# EAGLE design CCM_0010 (EAGLE 9.5.1)

## Sheet 1 of 3: doc
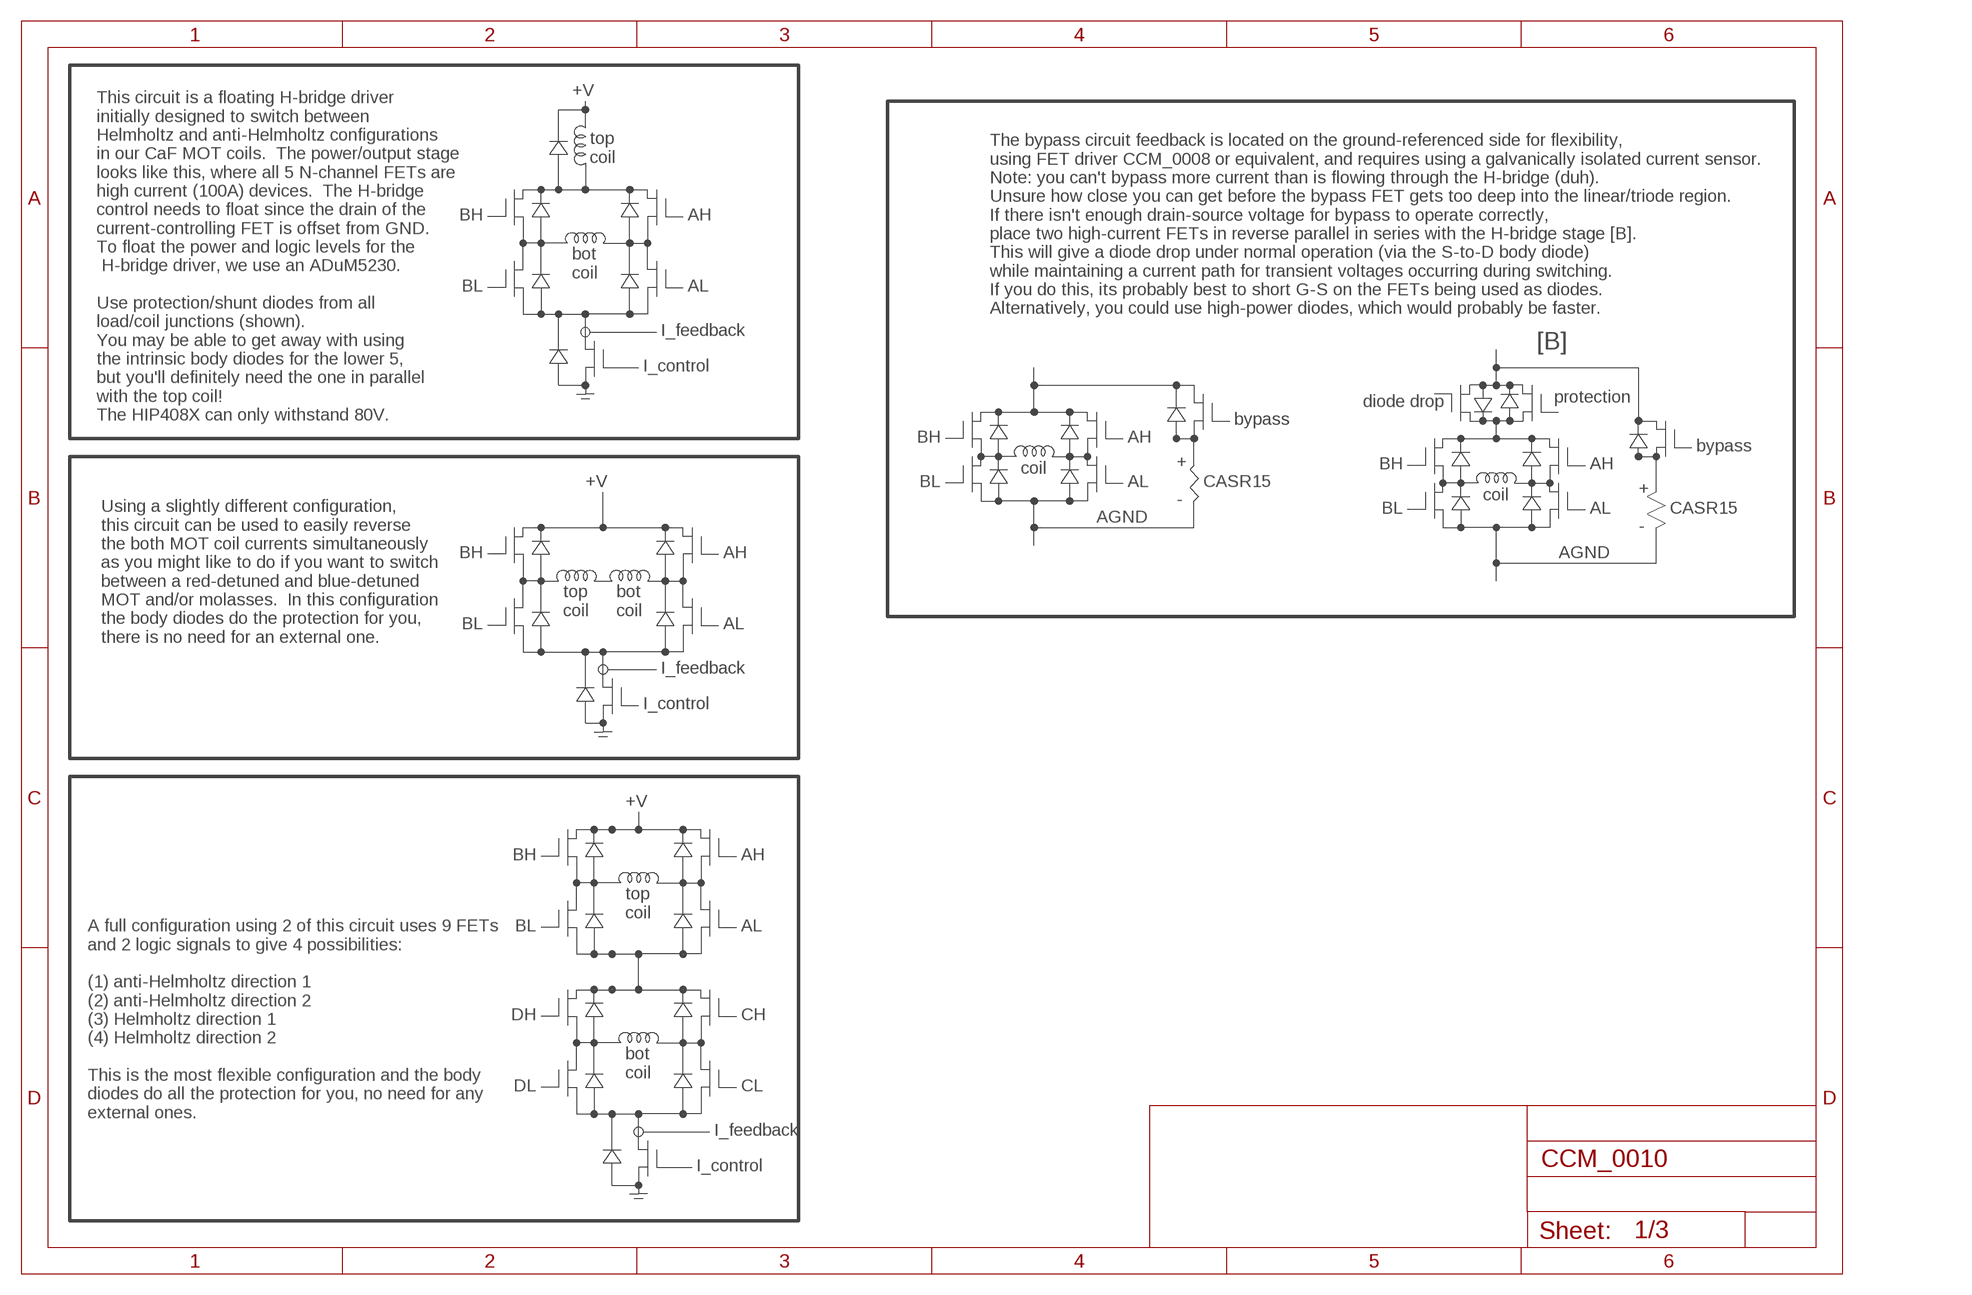
[diagram p0: schematic, sheet 1]

### Notes on the sheet
- +V
- top 
  coil
- BH | AH
- bot 
  coil
- BL | AL
- The bypass circuit feedback is located on the ground-referenced side for flexibility, 
  using FET driver CCM_0008 or equivalent, and requires using a galvanically isolated current sensor.
  Note: you can't bypass more current than is flowing through the H-bridge (duh).
  Unsure how close you can get before the bypass FET gets too deep into the linear/triode region.  
  If there isn't enough drain-source voltage for bypass to operate correctly,
  place two high-current FETs in reverse parallel in series with the H-bridge stage [B].
  This will give a diode drop under normal operation (via the S-to-D body diode)
  while maintaining a current path for transient voltages occurring during switching.
  If you do this, its probably best to short G-S on the FETs being used as diodes.
  Alternatively, you could use high-power diodes, which would probably be faster.
- I_feedback
- [B]
- I_control
- diode drop | protection
- This circuit is a floating H-bridge driver
  initially designed to switch between 
  Helmholtz and anti-Helmholtz configurations 
  in our CaF MOT coils.  The power/output stage 
  looks like this, where all 5 N-channel FETs are 
  high current (100A) devices.  The H-bridge 
  control needs to float since the drain of the 
  current-controlling FET is offset from GND.  
  To float the power and logic levels for the 
   H-bridge driver, we use an ADuM5230.
  
  Use protection/shunt diodes from all 
  load/coil junctions (shown).  
  You may be able to get away with using
  the intrinsic body diodes for the lower 5,
  but you'll definitely need the one in parallel
  with the top coil! 
  The HIP408X can only withstand 80V.
- bypass
- BH | AH
- bypass
- coil | BH | AH
- +V | BL | AL | CASR15
- coil
- +
  
  -
- BL | AL | CASR15
- AGND
- +
  
  -
- BH | AH | AGND
- top 
  coil
- bot 
  coil
- BL | AL
- Using a slightly different configuration, 
  this circuit can be used to easily reverse 
  the both MOT coil currents simultaneously 
  as you might like to do if you want to switch 
  between a red-detuned and blue-detuned 
  MOT and/or molasses.  In this configuration 
  the body diodes do the protection for you,
  there is no need for an external one.
- I_feedback
- I_control
- +V
- BH | AH
- top 
  coil
- BL | AL
- DH | CH
- bot 
  coil
- DL | CL
- A full configuration using 2 of this circuit uses 9 FETs
  and 2 logic signals to give 4 possibilities:
  
  (1) anti-Helmholtz direction 1
  (2) anti-Helmholtz direction 2
  (3) Helmholtz direction 1
  (4) Helmholtz direction 2
  
  This is the most flexible configuration and the body
  diodes do all the protection for you, no need for any
  external ones.
- I_feedback
- I_control

## Sheet 2 of 3: h-bridge drive
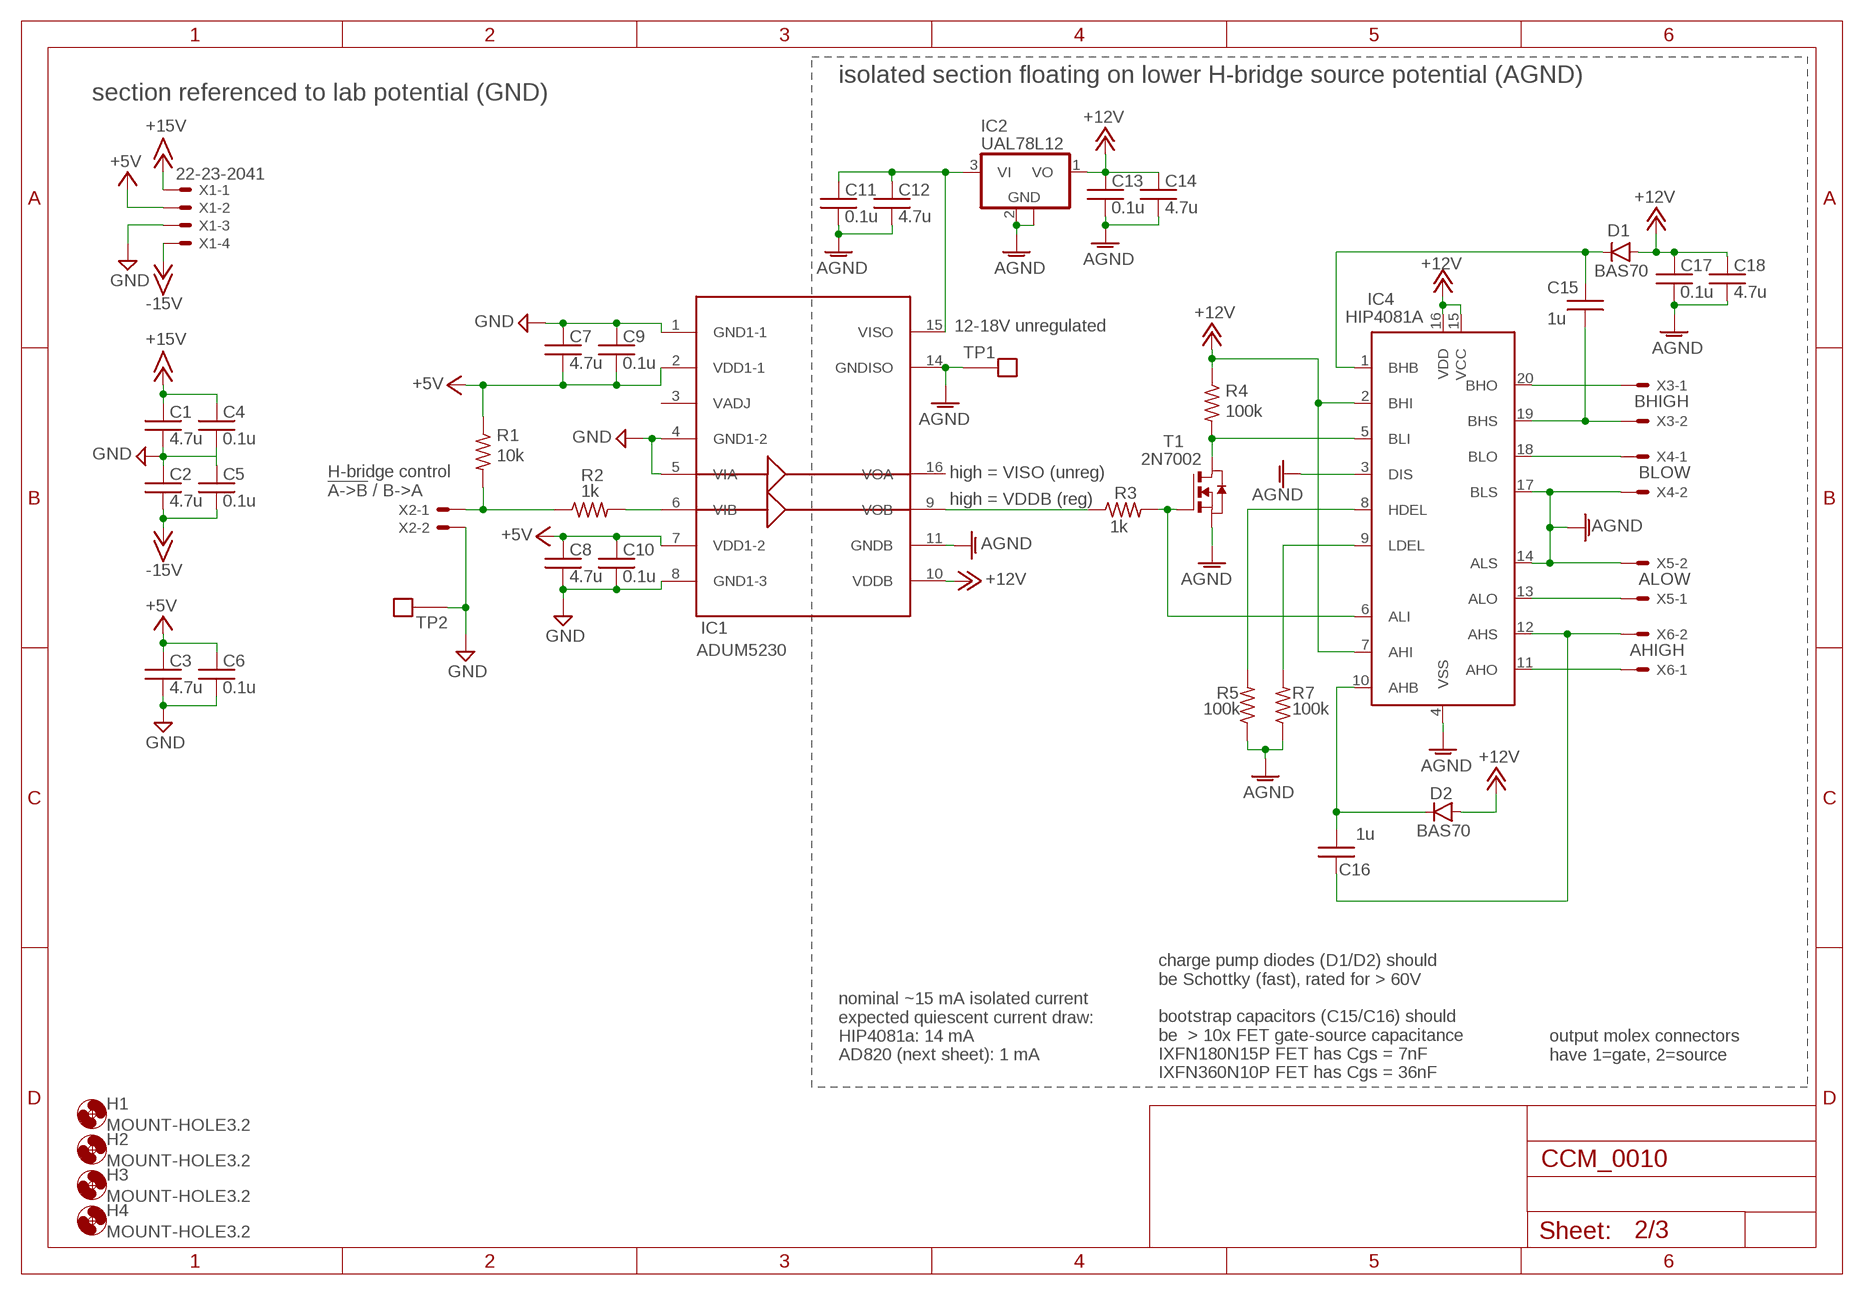
[diagram p1: schematic, sheet 2]

### Parts
C1  4.7u  C0603  [0603]
C2  4.7u  C0603  [0603]
C3  4.7u  C0603  [0603]
C4  0.1u  C0603  [0603]
C5  0.1u  C0603  [0603]
C6  0.1u  C0603  [0603]
C7  4.7u  C0603  [0603]
C8  4.7u  C0603  [0603]
C9  0.1u  C0603  [0603]
C10  0.1u  C0603  [0603]
C11  0.1u  C0603  [0603]
C12  4.7u  C0603  [0603]
C13  0.1u  C0603  [0603]
C14  4.7u  C0603  [0603]
C15  1u  C0603  [0603]
C16  1u  C0603  [0603]
C17  0.1u  C0603  [0603]
C18  4.7u  C0603  [0603]
D1  BAS70  DIODESOT23  [SOT23-3]
D2  BAS70  DIODESOT23  [SOT23-3]
H1  MOUNT-HOLE3.2  [3,2]
H2  MOUNT-HOLE3.2  [3,2]
H3  MOUNT-HOLE3.2  [3,2]
H4  MOUNT-HOLE3.2  [3,2]
IC1  ADUM5230  [SO16W]
IC2  UAL78L12  78L12F  [SOT89]
IC4  HIP4081A  [SO20]
R1  10k  R0603  [0603]
R2  1k  R0603  [0603]
R3  1k  R0603  [0603]
R4  100k  R0603  [0603]
R5  100k  R0603  [0603]
R7  100k  R0603  [0603]
T1  2N7002  NMOSSOT23  [SOT-23]
TP1  TESTPOINT  [TESTPOINT]
TP2  TESTPOINT  [TESTPOINT]
X1  22-23-2041  [22-23-2041]
X2  22-23-2021  [22-23-2021]
X3  22-23-2021  [22-23-2021]
X4  22-23-2021  [22-23-2021]
X5  22-23-2021  [22-23-2021]
X6  22-23-2021  [22-23-2021]

### Nets
+5V: C3.1 C6.1 C7.2 C8.1 C9.2 C10.1 IC1.2(VDD1-1) IC1.7(VDD1-2) R1.1 X1.2
+12V: C13.1 C14.1 C17.1 C18.1 D1.1(A) D2.1(A) IC1.10(VDDB) IC2.1(VO) IC4.2(BHI) IC4.7(AHI) IC4.15(VCC) IC4.16(VDD) R4.1 ; also sheet 3
+15V: C1.1 C4.1 X1.1 ; also sheet 3
-15V: C2.2 C5.2 X1.4 ; also sheet 3
AGND: C11.2 C12.2 C13.2 C14.2 C17.2 C18.2 IC1.11(GNDB) IC1.14(GNDISO) IC2.2(GND) IC2.2@1(GND) IC4.3(DIS) IC4.4(VSS) IC4.14(ALS) IC4.17(BLS) R5.1 R7.1 T1.2(S) TP1.P$1 X4.2 X5.2 ; also sheet 3
GND: C1.2 C2.1 C3.2 C4.2 C5.1 C6.2 C7.1 C8.2 C9.1 C10.2 IC1.1(GND1-1) IC1.4(GND1-2) IC1.5(VIA) IC1.8(GND1-3) TP2.P$1 X1.3 X2.2 ; also sheet 3
N$1: IC4.18(BLO) X4.1
N$4: IC4.13(ALO) X5.1
N$5: IC4.8(HDEL) R5.2
N$8: C16.1 D2.3(C) IC4.10(AHB)
N$10: C11.1 C12.1 IC1.15(VISO) IC2.3(VI)
N$13: IC1.9(VOB) R3.1
N$16: C16.2 IC4.12(AHS) X6.2
N$17: C15.2 D1.3(C) IC4.1(BHB)
N$20: IC4.9(LDEL) R7.2
N$21: IC4.5(BLI) R4.2 T1.1(D)
N$22: IC4.6(ALI) R3.2 T1.3(G)
N$23: C15.1 IC4.19(BHS) X3.2
N$24: IC4.20(BHO) X3.1
N$28: R1.2 R2.1 X2.1
N$30: IC1.6(VIB) R2.2
N$33: IC4.11(AHO) X6.1
Unconnected: IC1.3(VADJ) IC1.16(VOA)

### Notes on the sheet
- isolated section floating on lower H-bridge source potential (AGND)
- section referenced to lab potential (GND)
- 12-18V unregulated
- BHIGH
- high = VISO (unreg) | BLOW
- H-bridge control
  !A->B! / B->A
- high = VDDB (reg)
- ALOW
- AHIGH
- nominal ~15 mA isolated current
  expected quiescent current draw: 
  HIP4081a: 14 mA
  AD820 (next sheet): 1 mA
- output molex connectors
  have 1=gate, 2=source
- charge pump diodes (D1/D2) should
  be Schottky (fast), rated for > 60V
  
  bootstrap capacitors (C15/C16) should 
  be  > 10x FET gate-source capacitance
  IXFN180N15P FET has Cgs = 7nF
  IXFN360N10P FET has Cgs = 36nF

## Sheet 3 of 3: bypass
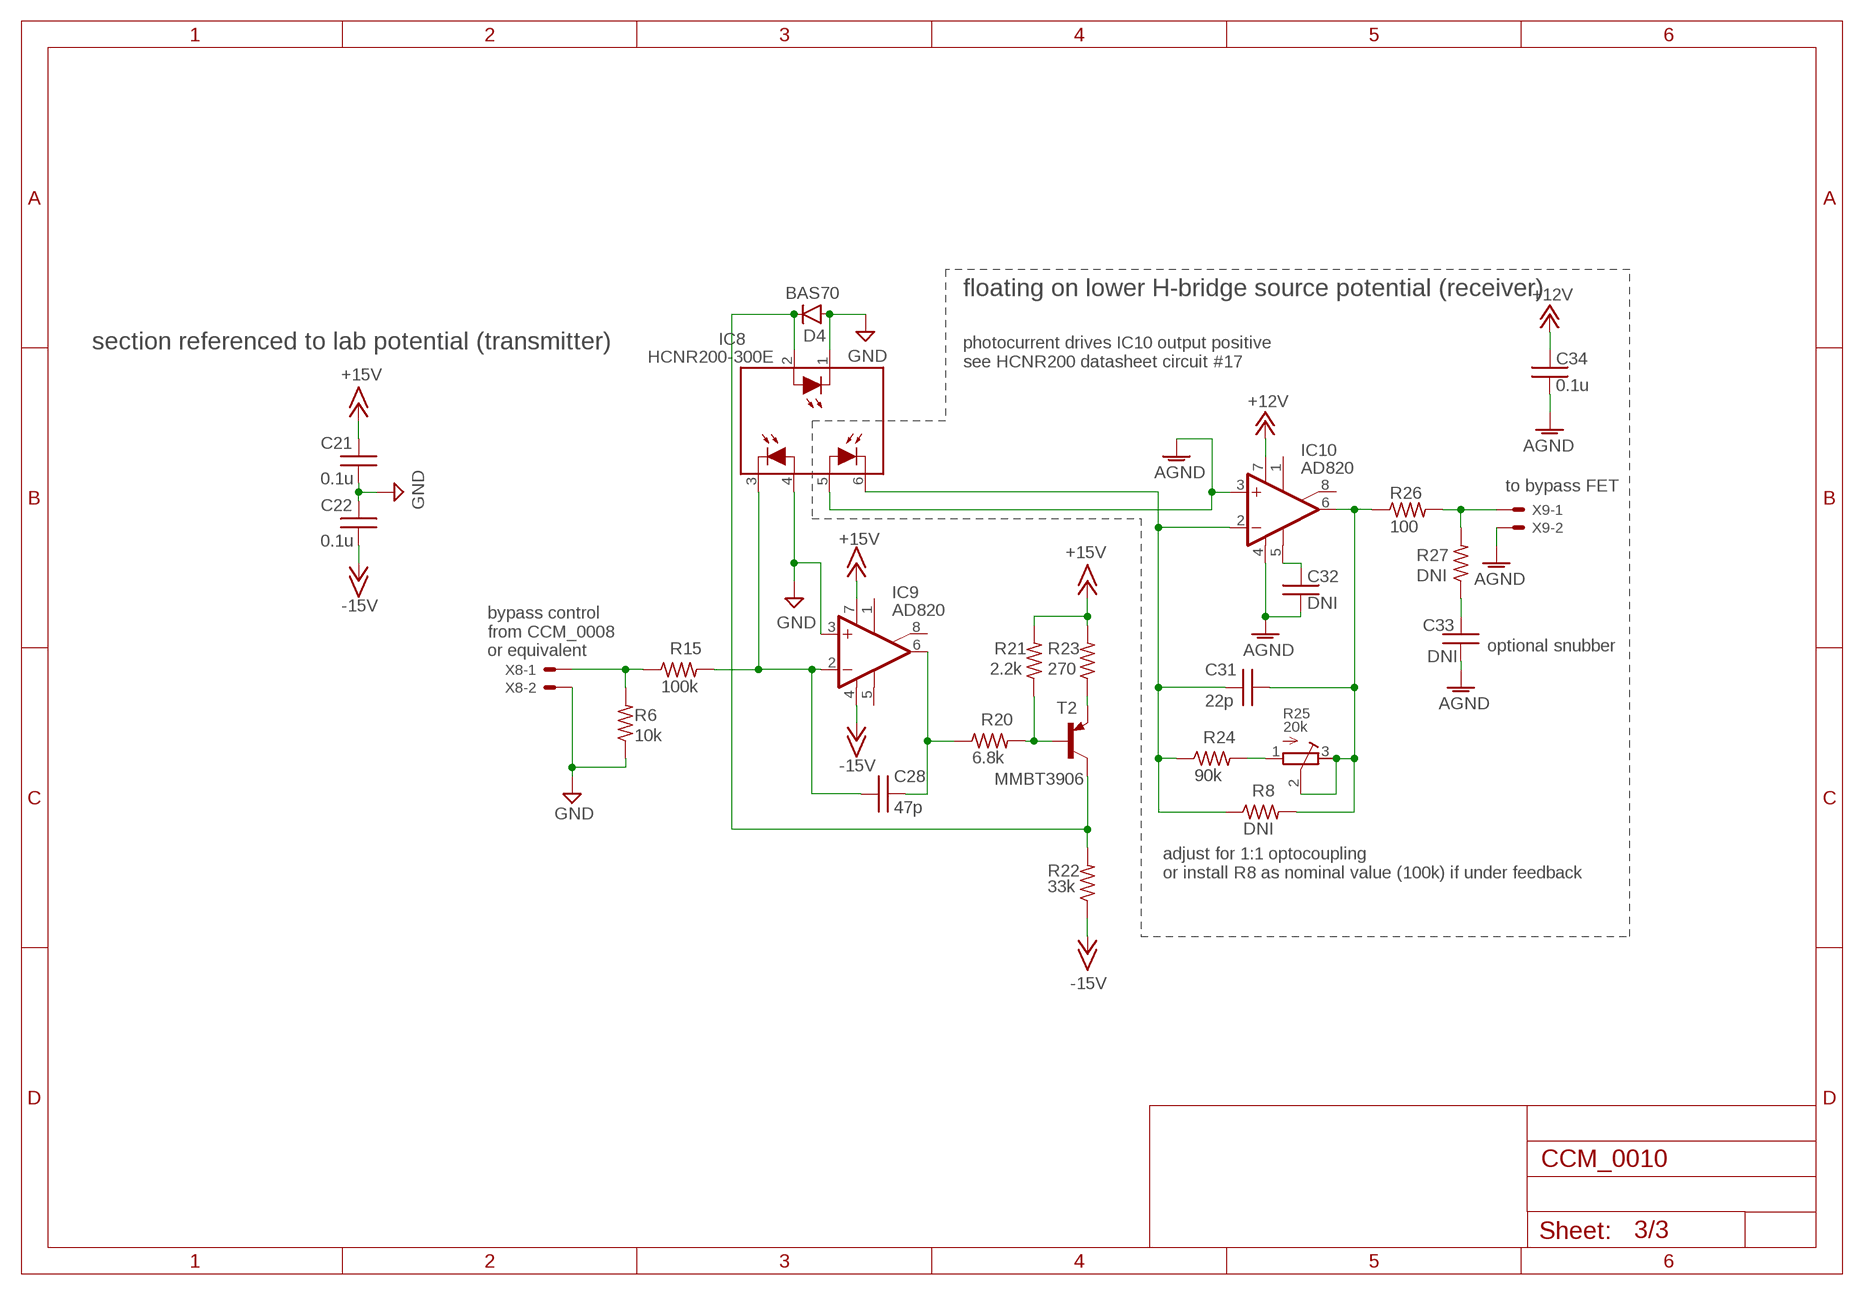
[diagram p2: schematic, sheet 3]

### Parts
C21  0.1u  C0603  [0603]
C22  0.1u  C0603  [0603]
C28  47p  C0603  [0603]
C31  22p  C0603  [0603]
C32  DNI  C0603  [0603]
C33  DNI  C0603  [0603]
C34  0.1u  C0603  [0603]
D4  BAS70  DIODESOT23  [SOT23-3]
IC8  HCNR200-300E  [DIP8-400]
IC9  AD820  OP07CR  [SO08]
IC10  AD820  OP07CR  [SO08]
R6  10k  R0603  [0603]
R8  DNI  R0603  [0603]
R15  100k  R0603  [0603]
R20  6.8k  R0603  [0603]
R21  2.2k  R0603  [0603]
R22  33k  R0603  [0603]
R23  270  R0603  [0603]
R24  90k  R0603  [0603]
R25  20k  R-TRIMM3224W  [RTRIM3224W]
R26  100  R0603  [0603]
R27  DNI  R0603  [0603]
T2  MMBT3906  MMBT3906LT1-PNP-SOT23-BEC  [SOT23-BEC]
X8  22-23-2021  [22-23-2021]
X9  22-23-2021  [22-23-2021]

### Nets
+12V: C34.1 IC10.7(V+) ; also sheet 2
+15V: C21.2 IC9.7(V+) R21.2 R23.2 ; also sheet 2
-15V: C22.1 IC9.4(V-) R22.1 ; also sheet 2
AGND: C32.2 C33.2 C34.2 IC8.5(A2) IC10.3(+IN) IC10.4(V-) X9.2 ; also sheet 2
GND: C21.1 C22.2 D4.1(A) IC8.1(C) IC8.4(A1) IC9.3(+IN) R6.1 X8.2 ; also sheet 2
N$2: C32.1 IC10.5(OPT)
N$3: D4.3(C) IC8.2(A) R22.2 T2.C
N$6: C33.1 R27.1
N$7: R6.2 R15.1 X8.1
N$9: C28.2 IC8.3(C1) IC9.2(-IN) R15.2
N$11: R24.2 R25.1(A)
N$12: C28.1 IC9.6(OUT) R20.1
N$14: R20.2 R21.1 T2.B
N$15: R23.1 T2.E
N$18: C31.2 IC8.6(C2) IC10.2(-IN) R8.1 R24.1
N$19: C31.1 IC10.6(OUT) R8.2 R25.2(S) R25.3(E) R26.1
N$27: R26.2 R27.2 X9.1
Unconnected: IC9.1(ON1) IC9.5(OPT) IC9.8(ON2) IC10.1(ON1) IC10.8(ON2)

### Notes on the sheet
- floating on lower H-bridge source potential (receiver)
- section referenced to lab potential (transmitter)
- photocurrent drives IC10 output positive
  see HCNR200 datasheet circuit #17
- to bypass FET
- optional snubber
- bypass control
  from CCM_0008
  or equivalent
- adjust for 1:1 optocoupling
  or install R8 as nominal value (100k) if under feedback

## Library data of the parts
C1-C18 C21 C22 C28 C31-C34 = acrooptics:C: Capacitor
D1 D2 D4 = WCSMain:DIODE: Diode These are standard reverse protection diodes and small signal diodes. SMA package can handle up to about 1A. SOD-323 can handle about 200mA. What the SOD-323 package when ordering, there are some mfgs out there that are 5-pin packages.
H1-H4 = holes:MOUNT-HOLE: MOUNTING HOLE with drill center marker
IC1 = noah:ADUM5230
IC2 = linear:78L*: POSITOIV-VOLTAGE REGULATORS Output up to 100 mA Source: Datasheet <http://focus.ti.com/lit/ds/symlink/ua78l05.pdf>
IC4 = noah:HIP4081A: H-Bridge N-Channel MOSFET Driver 80V, 0.5A
IC8 = avago:HCNR20*: High-Linearity Analog Optocouplers Source: AV02-0886EN+DS+HCNR200+10Dec2011.pdf
IC9 IC10 = linear:OP07*: OP AMP
R1-R8 R15 R20-R24 R26 R27 = acrooptics:R: 0603 resistor
R25 = resistor:R-TRIMM: Trimm resistor
T1 = zetex:NMOSSOT23: MOS FET; OC_FARNELL: unknown; OC_NEWARK: unknown
T2 = transistor:*-PNP-: PNP Transistror
TP1 TP2 = noah:TESTPOINT
X1 = con-molex:22-23-2041: .100" (2.54mm) Center Header - 4 Pin; MF: MOLEX; MPN: 22-23-2041; OC_FARNELL: 1462920; OC_NEWARK: 38C0355
X2-X6 X8 X9 = con-molex:22-23-2021: .100" (2.54mm) Center Header - 2 Pin; MF: MOLEX; MPN: 22-23-2021; OC_FARNELL: 1462926; OC_NEWARK: 25C3832

## Net classes
1 standard: width 0.61 mm, clearance 0.254 mm

## Board
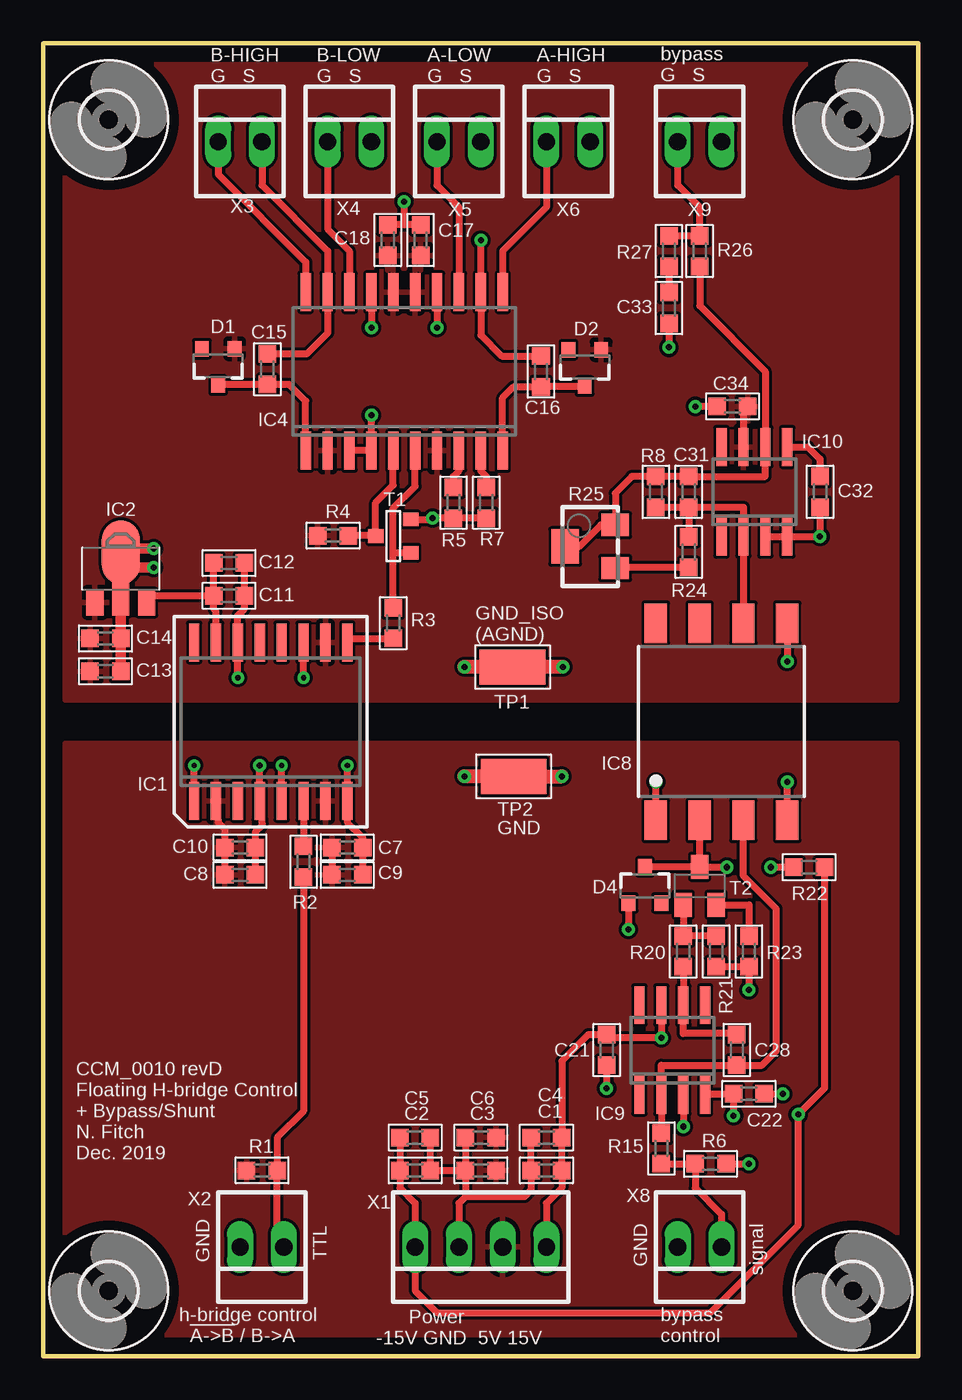
[diagram p3: board, top side]
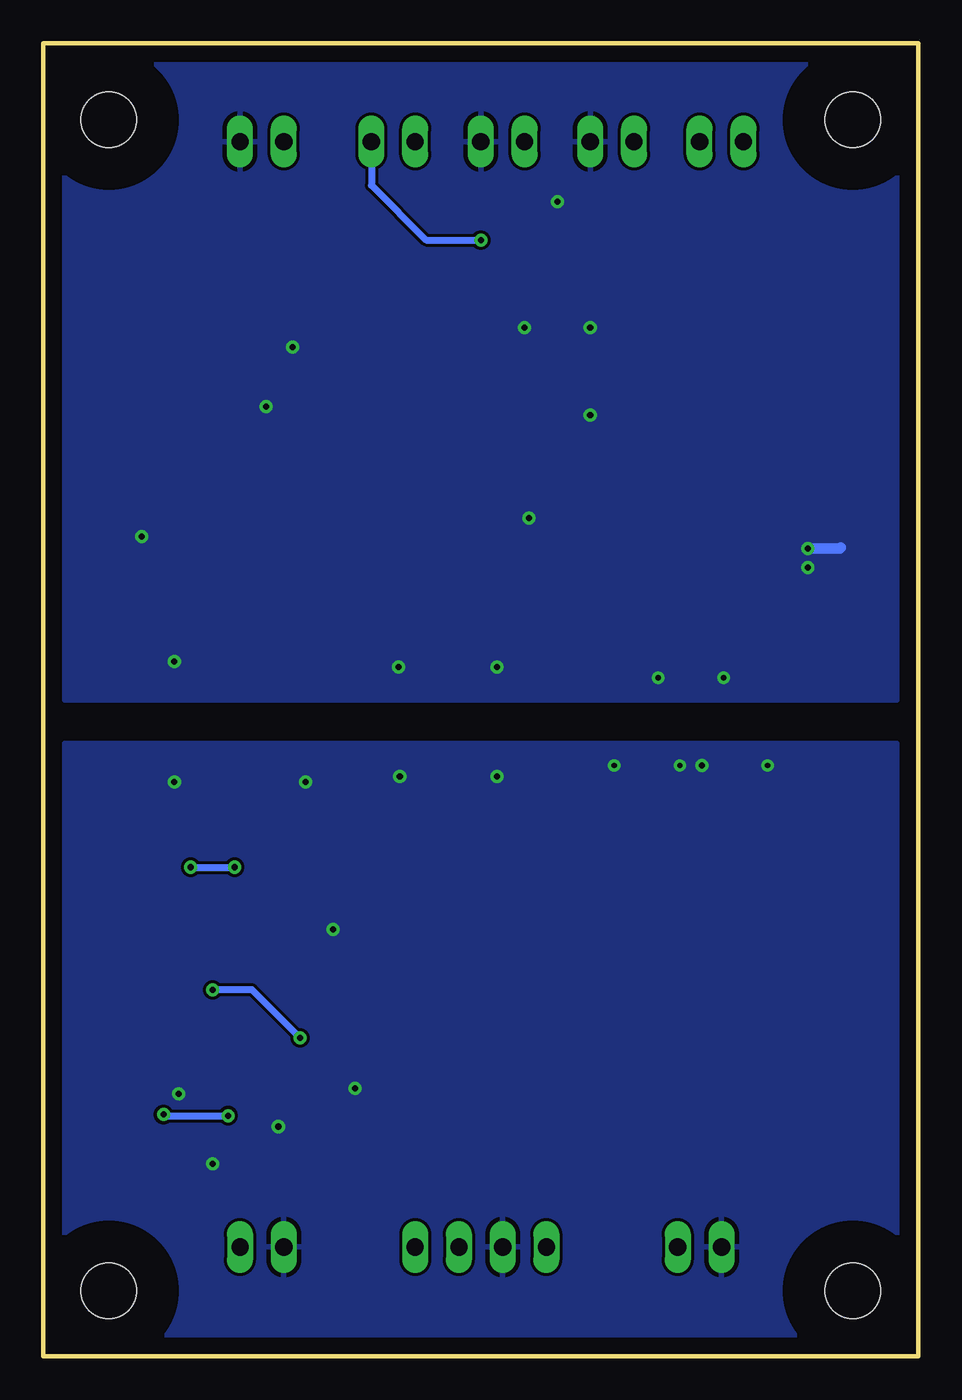
[diagram p4: board, bottom side, seen from below]

Size 50.8 x 76.2 mm. Coordinates in mm from the lower left corner, seen from the top.
Outline: 0,0 50.8,0 50.8,76.2 0,76.2 0,0
Copper layers (1*16): Top 0.035mm / dielectric 1.5mm / Bottom 0.035mm
Design rules "default *": minimum track width 10mil, minimum drill 10mil, track to track 7mil, track to pad 7mil, pad to pad 7mil, via to via 7mil, smd to smd 7mil, copper to edge 10mil, drill to drill 8mil, minimum pad ring 10mil, minimum via ring 8mil, stop-mask expansion 4mil, vias tented up to drill 0mil, thermal gap 10mil

### Footprints (pad centres in the part's own frame; a part is rotated, then mirrored left to right if it is on the bottom)
0603 = smd 1.016 x 1.016: 1 -0.889,0; 2 0.889,0
SOT23-3 = smd 0.8 x 0.9: 1 -0.95,-1; 2 0.95,-1; 3 0,1.1
3,2 = hole 3.2: 0,0
SO16W = smd 0.6 x 2.2: 1 -4.445,-4.6; 2 -3.175,-4.6; 3 -1.905,-4.6; 4 -0.635,-4.6; 5 0.635,-4.6; 6 1.905,-4.6; 7 3.175,-4.6; 8 4.445,-4.6; 9 4.445,4.6; 10 3.175,4.6; 11 1.905,4.6; 12 0.635,4.6; 13 -0.635,4.6; 14 -1.905,4.6; 15 -3.175,4.6; 16 -4.445,4.6
SOT89 = smd 1 x 1.5: 1 -1.499,-1.981; 3 1.499,-1.981 | smd 1 x 2: 2 0,-1.727 | smd 2.2 x 3.7: 2@1 0,0.94
SO20 = smd 0.6 x 2.2: 1 -5.715,-4.6; 2 -4.445,-4.6; 3 -3.175,-4.6; 4 -1.905,-4.6; 5 -0.635,-4.6; 6 0.635,-4.6; 7 1.905,-4.6; 8 3.175,-4.6; 9 4.445,-4.6; 10 5.715,-4.6; 11 5.715,4.6; 12 4.445,4.6; 13 3.175,4.6; 14 1.905,4.6; 15 0.635,4.6; 16 -0.635,4.6; 17 -1.905,4.6; 18 -3.175,4.6; 19 -4.445,4.6; 20 -5.715,4.6
DIP8-400 = smd 1.3 x 2.29: 1 -3.81,-5.72; 2 -1.27,-5.72; 3 1.27,-5.72; 4 3.81,-5.72; 5 3.81,5.72; 6 1.27,5.72; 7 -1.27,5.72; 8 -3.81,5.72
SO08 = smd 0.6 x 2.2: 1 -1.905,-2.6; 2 -0.635,-2.6; 3 0.635,-2.6; 4 1.905,-2.6; 5 1.905,2.6; 6 0.635,2.6; 7 -0.635,2.6; 8 -1.905,2.6
RTRIM3224W = smd 1.3 x 1.6: 1 -1.25,-1.45; 3 1.25,-1.45 | smd 2 x 1.6: 2 0,1.45
SOT-23 = smd 0.787 x 0.889: 1 0.025,-1.016; 2 -0.94,1.016; 3 0.991,1.016
SOT23-BEC = smd 1 x 1.4: B -0.95,-1.1; C 0,1.1; E 0.95,-1.1
TESTPOINT = smd 3.81 x 2.032: P$1 0,0
22-23-2041 = drill 1 long: 1 -3.81,0; 2 -1.27,0; 3 1.27,0; 4 3.81,0
22-23-2021 = drill 1 long: 1 -1.27,0; 2 1.27,0

### Placement (x,y rotation side)
C1  29.21,10.79 180 top
C2  21.59,10.79 180 top
C3  25.4,10.79 180 top
C4  29.21,12.7 180 top
C5  21.59,12.7 180 top
C6  25.4,12.7 180 top
C7  17.65,29.53 180 top
C8  11.43,27.94 0 top
C9  17.65,27.94 180 top
C10  11.43,29.53 0 top
C11  10.79,44.13 0 top
C12  10.79,46.04 0 top
C13  3.62,39.75 0 top
C14  3.62,41.66 0 top
C15  13.02,57.28 270 top
C16  28.89,57.15 90 top
C17  21.91,64.77 90 top
C18  20,64.77 90 top
C21  32.7,17.78 90 top
C22  40.96,15.24 0 top
C28  40.26,17.78 270 top
C31  37.47,50.16 270 top
C32  45.09,50.16 270 top
C33  36.32,60.83 270 top
C34  40.01,55.12 180 top
D1  10.16,57.47 180 top
D2  31.43,57.4 180 top
D4  34.92,27.3 0 top
H1  3.81,3.81 0 top
H2  46.99,3.81 0 top
H3  3.81,71.75 0 top
H4  46.99,71.75 0 top
IC1  13.21,36.83 0 top
IC2  4.51,45.72 0 top
IC4  20.95,57.15 0 top
IC8  39.37,36.83 0 top
IC9  36.51,17.78 0 top
IC10  41.27,50.16 0 top
R1  12.7,10.79 0 top
R2  15.11,28.7 90 top
R3  20.32,42.55 90 top
R4  16.83,47.62 0 top
R5  23.81,49.53 90 top
R6  38.73,11.18 180 top
R7  25.72,49.53 90 top
R8  35.56,50.16 90 top
R15  35.88,12.06 90 top
R20  37.15,23.5 90 top
R21  39.05,23.5 270 top
R22  44.45,28.38 180 top
R23  40.96,23.5 270 top
R24  37.47,46.67 270 top
R25  31.75,46.99 90 top
R26  38.1,64.14 90 top
R27  36.32,64.14 90 top
T1  20.32,47.62 270 top
T2  38.1,27.3 0 top
TP1  27.24,40.01 180 top
TP2  27.3,33.66 0 top
X1  25.4,6.35 180 top
X2  12.7,6.35 180 top
X3  11.43,70.48 0 top
X4  17.78,70.48 0 top
X5  24.13,70.48 0 top
X6  30.48,70.48 0 top
X8  38.1,6.35 180 top
X9  38.1,70.48 0 top

### Tracks (layer width: path | path; a pad name or v marks a point on that pad's centre or on a via)
+5V
  Top 0.406: IC1.2 10.16,30.99 10.54,30.61 C10.1 C8.1 | C7.2 C9.2
  pour Top: 1.27,1.27 1.27,35.56 49.53,35.56 49.53,1.27
+12V
  Top 0.406: C34.1 40.64,54.86 IC10.7
  pour Top: 49.53,74.93 1.27,74.93 1.27,38.1 49.53,38.1
+15V  (via drill 0.35)
  Top 0.406: X1.1 29.21,8.89 30.1,9.78 C1.1 C4.1 30.1,17.14 31.62,18.67 C21.2 32.89,18.48 v35.88,18.48 IC9.7 | R21.2 R23.2 v40.96,21.27
  Bottom 0.406: v35.88,18.48 38.67,21.27 v40.96,21.27
-15V  (via drill 0.35)
  Top 0.406: C5.2 C2.2 20.7,9.78 21.59,8.89 X1.4 21.59,3.81 22.86,2.54 38.73,2.54 43.81,7.62 v43.81,14.03 45.34,15.56 R22.1 | IC9.4 38.48,15.24 C22.1 v40.07,13.97
  Bottom 0.406: v43.81,14.03 43.75,13.97 v40.07,13.97
AGND  (via drill 0.3, 0.35)
  Top 0.406: v15.11,39.37 IC1.11 | v11.3,39.37 IC1.14 11.3,42.99 11.68,43.37 C11.2 C12.2 | C17.2 20.95,65.66 | 20.95,65.66 C18.2 | v20.95,66.99 20.95,65.66 | IC10.3 IC10.4 v45.08,47.56 | C33.2 v36.32,58.55 | C34.2 v37.85,55.12 | v45.08,47.56 v45.09,47.56 | C32.2 v45.08,47.56 | IC8.5 v43.18,40.32 | IC4.17 v19.05,59.69 | IC4.14 v22.86,59.69 | IC4.3 IC4.4 v19.05,54.61 | T1.2 22.53,48.56 v22.61,48.64 R5.1 R7.1
  Top 0.61: IC2.2@1 IC2.2 C14.2 C13.2 | IC2.2@1 5.38,45.78 v6.41,45.78 | IC2.2@1 4.71,46.86 v6.41,46.86
  Top 0.813: v30.16,40.01 TP1.P$1 v24.45,40.01
  Bottom 0.61: v6.41,46.86 4.57,46.86 4.51,46.93
  pour Bottom: 1.27,38.1 1.27,74.93 49.53,74.93 49.53,38.1
GND  (via drill 0.3, 0.35)
  Top 0.406: IC1.5 v13.84,34.29 | v17.65,34.29 IC1.8 17.65,30.99 18.54,30.1 C7.1 C9.1 | IC1.1 v8.76,34.29 | C8.2 C10.2 12.32,30.42 12.7,30.8 IC1.4 v12.57,34.29 | C6.2 C3.2 | C3.2 24.51,9.27 | 24.51,9.27 24.13,8.89 X1.3 | C4.2 C1.2 28.32,9.65 27.94,9.27 24.51,9.27 | IC8.4 v43.18,33.34 | C5.1 C2.1 C3.2 | C22.2 v42.93,15.24 | IC9.3 v37.15,13.34 | C21.1 v32.7,15.56 | R6.1 v40.96,11.18 | IC8.1 v35.56,33.34 | D4.1 v33.98,24.77 v33.97,24.77
  Top 0.813: v24.45,33.66 TP2.P$1 v30.1,33.66
  pour Bottom: 1.27,1.27 1.27,35.56 49.53,35.56 49.53,1.27
N$1
  Top 0.406: X4.1 16.51,65.41 17.78,64.14 IC4.18
N$2
  Top 0.406: IC10.5 44.39,52.77 45.09,52.07 C32.1
N$3  (via drill 0.35)
  Top 0.406: T2.C D4.3 | T2.C IC8.2 | R22.2 v42.23,28.38 | v39.69,28.38 38.1,28.38 T2.C
  Bottom 0.406: v42.23,28.38 v39.69,28.38
N$4
  Top 0.406: X5.1 22.86,67.94 24.13,66.67 IC4.13
N$5
  Top 0.406: IC4.8 24.13,51.37 23.81,51.05 R5.2
N$6
  Top 0.406: R27.1 C33.1
N$7
  Top 0.406: R15.1 R6.2 37.85,9.78 39.37,8.26 X8.1
N$8
  Top 0.406: D2.3 28.94,56.3 C16.1 27.3,56.26 26.67,55.63 IC4.10
N$9
  Top 0.406: R15.2 IC9.2 35.88,16.89 C28.2 41.72,16.89 42.55,17.72 42.55,25.97 40.64,27.88 IC8.3
N$10
  Top 0.406: IC2.3 6.4,44.13 C11.1 | C11.1 C12.1 | IC1.15 10.03,43.24 9.91,43.37 C11.1
N$11
  Top 0.406: R24.2 32.96,45.78 R25.1
N$12
  Top 0.406: C28.1 40.2,18.73 37.15,18.73 IC9.6 R20.1
N$13
  Top 0.406: IC1.9 17.65,41.66 R3.1
N$14
  Top 0.406: 37.21,24.45 R20.2 | R21.1 37.21,24.38 37.21,24.45 | T2.B 37.15,24.45 37.21,24.45
N$15
  Top 0.406: T2.E 40.96,26.2 R23.1
N$16  (via drill 0.35)
  Top 0.406: v25.4,64.77 IC4.12 25.4,59.24 26.61,58.04 C16.2
  Bottom 0.406: X6.2 31.75,67.94 28.57,64.77 v25.4,64.77
N$17
  Top 0.406: D1.3 10.18,56.39 C15.2 14.29,56.39 15.24,55.44 IC4.1
N$18
  Top 0.406: C31.2 40.64,49.28 IC10.2 IC8.6 | C31.2 R24.1 | R8.1 C31.2
N$19
  Top 0.406: R26.1 38.1,60.96 41.91,57.15 IC10.6 41.91,51.05 C31.1 R8.2 34.16,51.05 33.2,50.09 R25.3 32.37,48.24 31.11,46.99 R25.2
N$20
  Top 0.406: IC4.9 25.4,51.37 25.72,51.05 R7.2
N$21
  Top 0.406: IC4.5 20.32,50.55 19.3,49.53 T1.1 19.28,47.62 R4.2
N$22
  Top 0.406: R3.2 20.32,46.61 | 20.32,46.61 20.32,49.21 21.59,50.48 IC4.6 | T1.3 21.31,46.61 20.32,46.61
N$23
  Top 0.406: C15.1 15.3,58.17 16.51,59.37 IC4.19 16.51,64.14 12.7,67.94 X3.2
N$24
  Top 0.406: X3.1 10.16,68.58 15.24,63.5 IC4.20
N$27
  Top 0.406: R27.2 R26.2 38.1,66.67 36.83,67.94 X9.1
N$28
  Top 0.406: X2.1 13.59,6.73 R1.2 13.59,12.7 15.11,14.22 R2.1
N$30
  Top 0.406: IC1.6 R2.2
N$33
  Top 0.406: X6.1 29.21,66.67 26.67,64.14 IC4.11

### Text on the board
tPlace: B-HIGH / G S | B-LOW / G S | A-LOW / G S | A-HIGH / G S | bypass / G S | GND_ISO / (AGND) | GND | CCM_0010 revD / Floating H-bridge Control / + Bypass/Shunt / N. Fitch / Dec. 2019 | TTL | GND | GND | signal | h-bridge control / !A->B! / B->A | Power / -15V GND 5V 15V | bypass / control